# Altium schematic sheet Adapter.SchDoc
size A
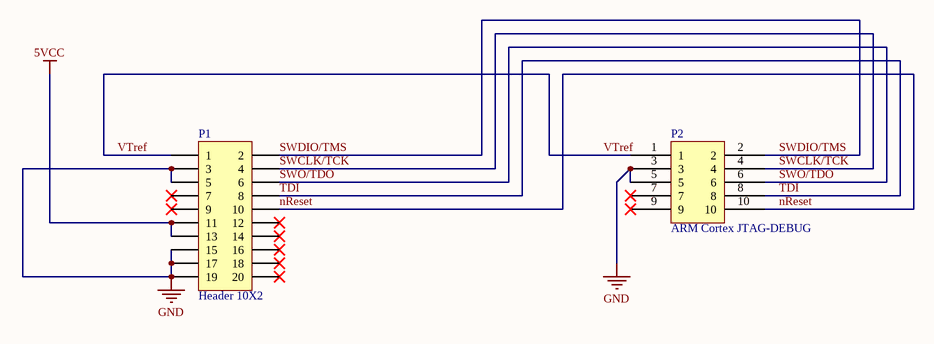
[diagram p0: Adapter.SchDoc]

## Parts
P1  Header 10X2  [HDR2X10]
P2  ARM Cortex JTAG-DEBUG  [FTSH-105-XX-X-DV]

## Nets
5VCC: P1.11 P1.13
GND: P1.3 P1.5 P1.15 P1.17 P1.19 P2.3 P2.5
nReset: P1.10 P2.10
SWCLK/TCK: P1.4 P2.4
SWDIO/TMS: P1.2 P2.2
SWO/TDO: P1.6 P2.6
TDI: P1.8 P2.8
VTref: P1.1 P2.1

Not connected (* = marked no-connect by the designer): P1 7* 9* 12* 14* 16* 18* 20*; P2 7* 9*

## Library data of the parts
P1 = Header 10X2: Header, 10-Pin, Dual row; LatestRevisionDate: 17-Jul-2002; LatestRevisionNote: Re-released for DXP Platform.; Publisher: Altium Limited
P2 = ARM Cortex JTAG-DEBUG Header